# EAGLE design AutoDriver Shield (EAGLE 7.1.0)
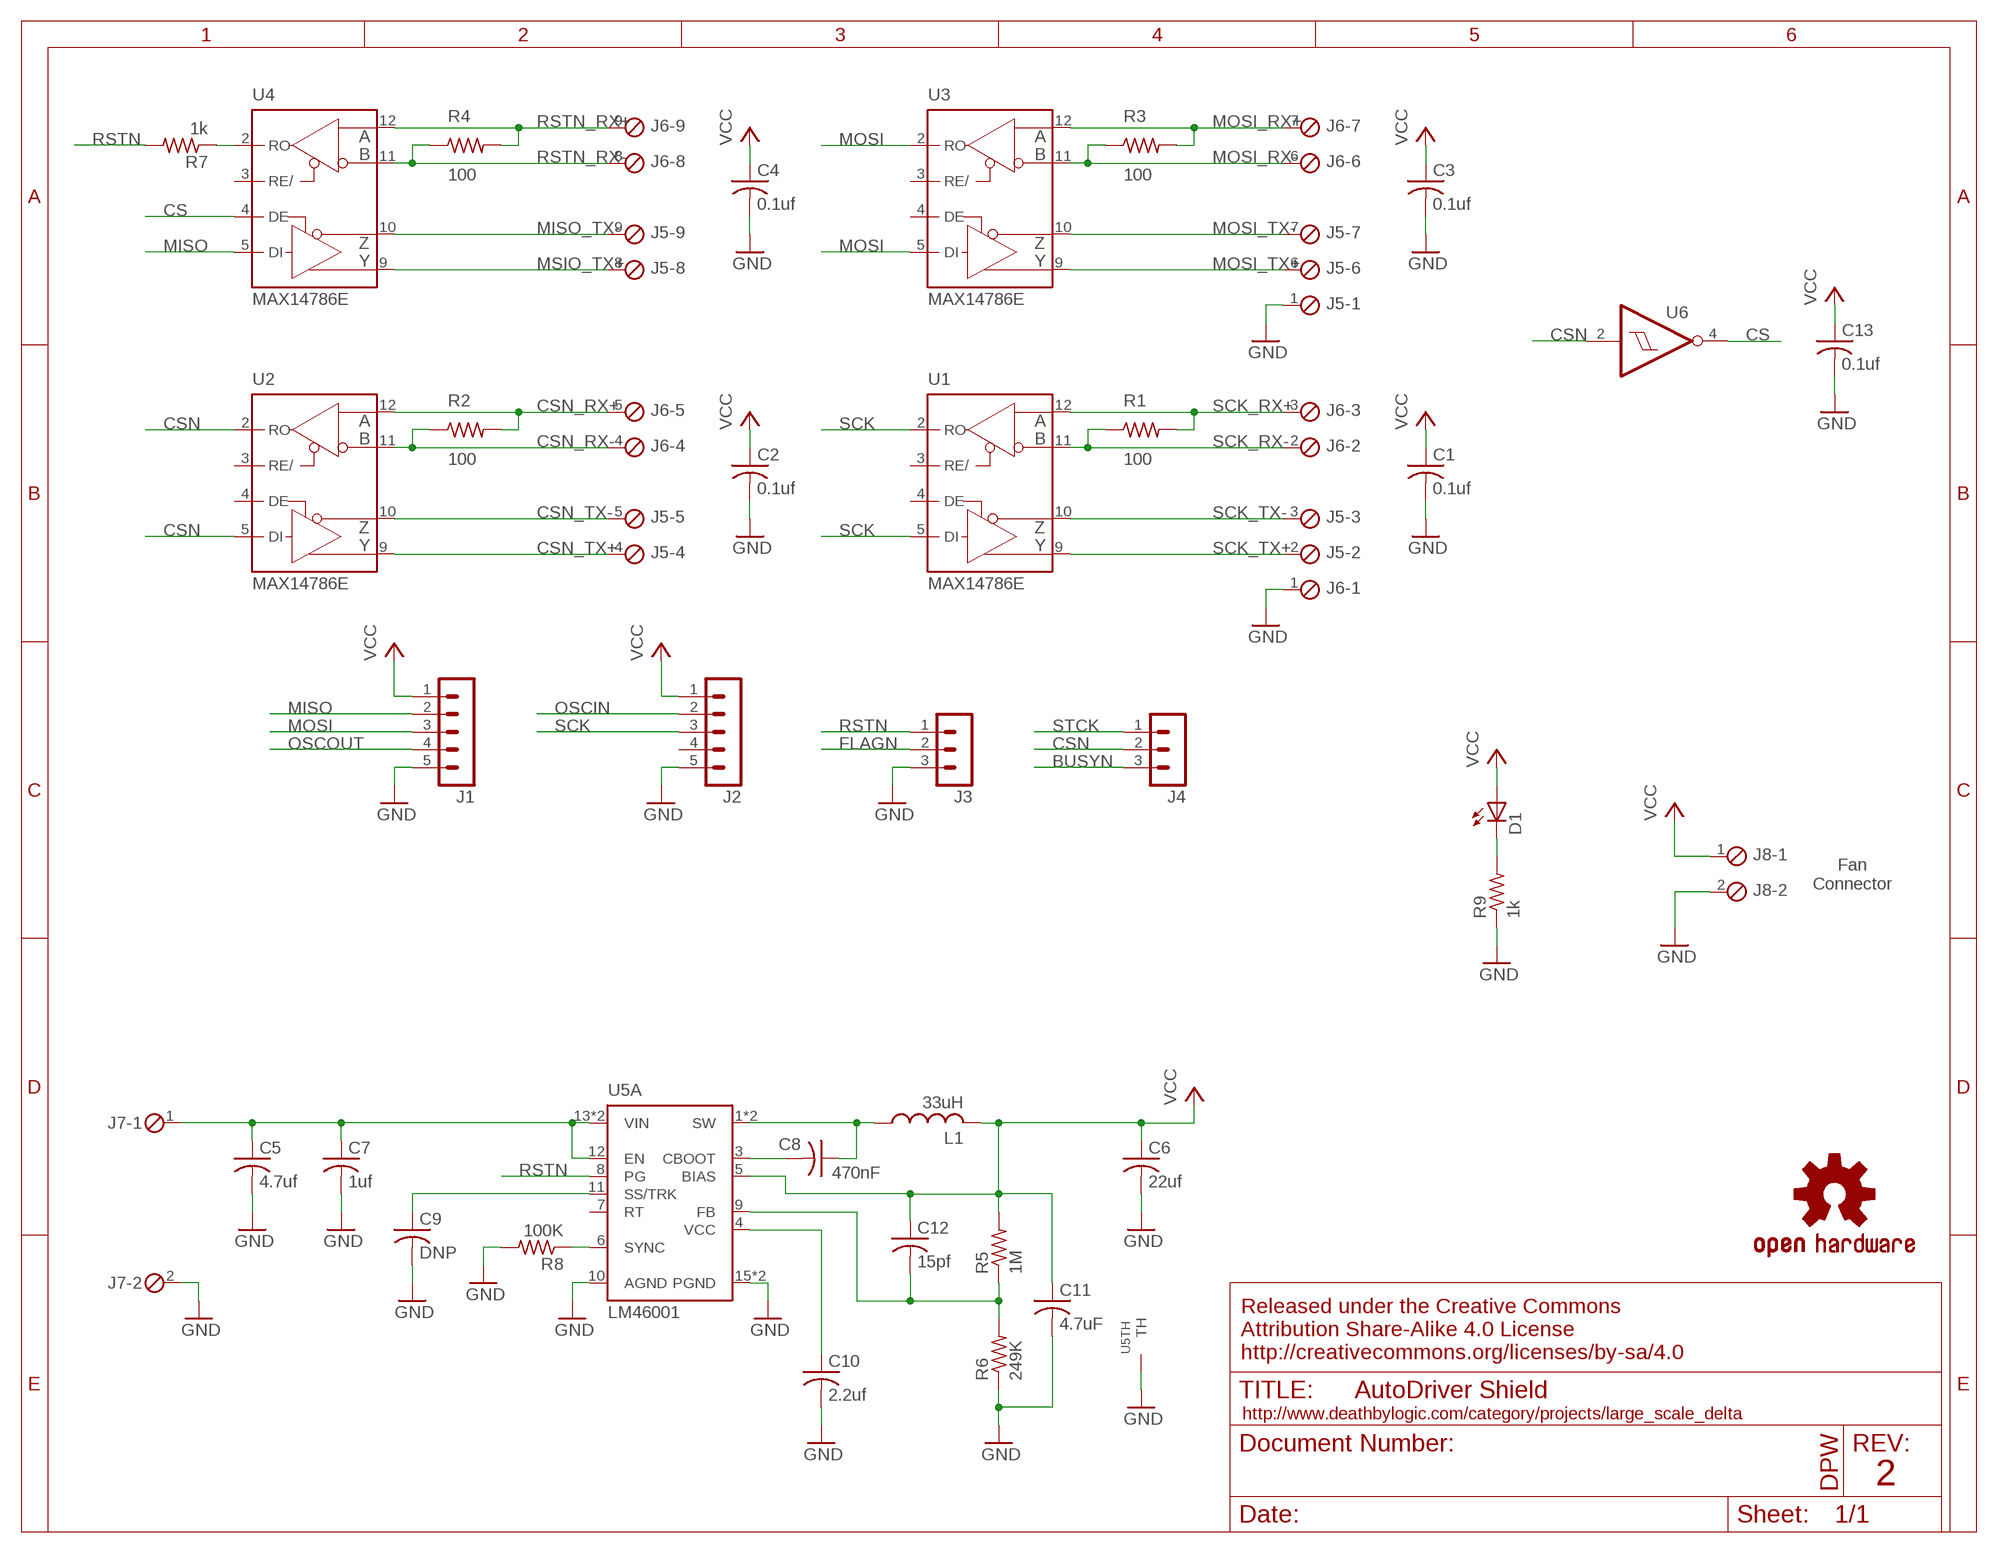
[diagram p0: schematic, sheet 1]

## Parts
C1  0.1uf  C-USC0805K  [C0805K]
C2  0.1uf  C-USC0805K  [C0805K]
C3  0.1uf  C-USC0805K  [C0805K]
C4  0.1uf  C-USC0805K  [C0805K]
C5  4.7uf  C-USC1210K  [C1210K]
C6  22uf  C-USC1210K  [C1210K]
C7  1uf  C-USC1206K  [C1206K]
C8  470nF  C-USC0805K  [C0805K]
C9  DNP  C-USC0603K  [C0603K]
C10  2.2uf  C-USC0603K  [C0603K]
C11  4.7uF  C-USC0805K  [C0805K]
C12  15pf  C-USC0805K  [C0805K]
C13  0.1uf  C-USC0805K  [C0805K]
D1  LEDCHIPLED_0805  [CHIPLED_0805]
J1  MA05-1  [MA05-1]
J2  MA05-1  [MA05-1]
J3  MA03-1  [MA03-1]
J4  MA03-1  [MA03-1]
J5  MPT9  [9POL254]
J6  MPT9  [9POL254]
J7  MPT2  [2POL254]
J8  MPT2  [2POL254]
L1  33uH  SRN6045  [L6045]
LOGO1  OSHW-LOGOM  [OSHW-LOGO-M]
R1  100  R-US_R1206  [R1206]
R2  100  R-US_R1206  [R1206]
R3  100  R-US_R1206  [R1206]
R4  100  R-US_R1206  [R1206]
R5  1M  R-US_R0402  [R0402]
R6  249K  R-US_R0402  [R0402]
R7  1k  R-US_R0805  [R0805]
R8  100K  R-US_R0402  [R0402]
R9  1k  R-US_R0805  [R0805]
U1  MAX14786E  MAX489CSD  [SO14]
U2  MAX14786E  MAX489CSD  [SO14]
U3  MAX14786E  MAX489CSD  [SO14]
U4  MAX14786E  MAX489CSD  [SO14]
U5  LM46001  [HTSSOP16PWP]
U6  74AHC1G14  74AHC1G14DBV  [SOT23-5]
U$2  PENGUIN_LOGOSILKSCREEN  [PENGUIN_SILKSCREEN]

## Nets
BUSYN: J4.3
CS: U4.4(DE) U6.4(O)
CSN: J4.2 U2.2(RO) U2.5(DI) U6.2(I)
CSN_RX+: J6.5 R2.2 U2.12(A)
CSN_RX-: J6.4 R2.1 U2.11(B)
CSN_TX+: J5.4 U2.9(Y)
CSN_TX-: J5.5 U2.10(Z)
FLAGN: J3.2
GND: C1.2 C2.2 C3.2 C4.2 C5.2 C6.2 C7.2 C9.2 C10.2 C11.2 C13.2 J1.5 J2.5 J3.3 J5.1 J6.1 J7.2 J8.2 R6.1 R8.2 R9.1 U5.10(A:AGND) U5.15(A:PGND) U5.16(A:PGND) U5.TH1(TH:TH) U5.TH2(TH:TH) U5.TH3(TH:TH) U5.TH4(TH:TH) U5.TH5(TH:TH) U5.TH6(TH:TH) U5.TH7(TH:TH) U5.TH8(TH:TH) U5.TH9(TH:TH) U5.TH10(TH:TH) U5.TH11(TH:TH) U5.TH12(TH:TH) U5.THA(TH:TH) U5.THB(TH:TH)
MISO: J1.2 U4.5(DI)
MISO_TX-: J5.9 U4.10(Z)
MOSI: J1.3 U3.2(RO) U3.5(DI)
MOSI_RX+: J6.7 R3.2 U3.12(A)
MOSI_RX-: J6.6 R3.1 U3.11(B)
MOSI_TX+: J5.6 U3.9(Y)
MOSI_TX-: J5.7 U3.10(Z)
MSIO_TX+: J5.8 U4.9(Y)
N$1: D1.C R9.2
N$3: C5.1 C7.1 J7.1 U5.12(A:EN) U5.13(A:VIN) U5.14(A:VIN)
N$6: C9.1 U5.11(A:SS/TRK)
N$8: R8.1 U5.6(A:SYNC)
N$9: C8.1 L1.P$1 U5.1(A:SW) U5.2(A:SW)
N$10: C8.2 U5.3(A:CBOOT)
N$11: R7.1 U4.2(RO)
N$12: C10.1 U5.4(A:VCC)
N$15: C12.2 R5.1 R6.2 U5.9(A:FB)
OSCIN: J2.2
OSCOUT: J1.4
RSTN: J3.1 R7.2 U5.8(A:PG)
RSTN_RX+: J6.9 R4.2 U4.12(A)
RSTN_RX-: J6.8 R4.1 U4.11(B)
SCK: J2.3 U1.2(RO) U1.5(DI)
SCK_RX+: J6.3 R1.2 U1.12(A)
SCK_RX-: J6.2 R1.1 U1.11(B)
SCK_TX+: J5.2 U1.9(Y)
SCK_TX-: J5.3 U1.10(Z)
STCK: J4.1
VCC: C1.1 C2.1 C3.1 C4.1 C6.1 C11.1 C12.1 C13.1 D1.A J1.1 J2.1 J8.1 L1.P$2 R5.2 U5.5(A:BIAS)
Unconnected: J2.4 U1.1(NC) U1.3(RE/) U1.4(DE) U1.8(NC) U1.13(NC) U2.1(NC) U2.3(RE/) U2.4(DE) U2.8(NC) U2.13(NC) U3.1(NC) U3.3(RE/) U3.4(DE) U3.8(NC) U3.13(NC) U4.1(NC) U4.3(RE/) U4.8(NC) U4.13(NC) U5.7(A:RT)

## Notes on the sheet
- Fan
  Connector
- Released under the Creative Commons
  Attribution Share-Alike 4.0 License
  http://creativecommons.org/licenses/by-sa/4.0
- http://www.deathbylogic.com/category/projects/large_scale_delta
- 2

## Power pins joined to a net without a drawn wire
GND: U1.6(GND) U1.7(GND) U2.6(GND) U2.7(GND) U3.6(GND) U3.7(GND) U4.6(GND) U4.7(GND) U6.3(GND)
VCC: U1.14(VCC) U2.14(VCC) U3.14(VCC) U4.14(VCC) U6.5(VCC)

## Library data of the parts
C1-C13 = resistor:C-US: CAPACITOR, American symbol
D1 = led:LED: LED OSRAM: - CHIPLED LG R971, LG N971, LY N971, LG Q971, LY Q971, LO R971, LY R971 LH N974, LH R974 LS Q976, LO Q976, LY Q976 LO Q996 - Hyper CHIPLED LW Q18S LB Q993, LB Q99A, LB R99A - SideLED LS A670, LO A670, LY A670, LG A670, LP A670 LB A673, LV A673, LT A673, LW A673 LH A674 LY A675 LS A676, LA A676, LO A676, LY A676, LW A676 LS A679, LY A679, LG A679 - Hyper Micro SIDELED® LS Y876, LA Y876, LO Y876, LY Y876 LT Y87S - SmartLED LW L88C, LW L88S LB L89C, LB L89S, LG L890 LS L89K, LO L89K, LY L89K LS L896, LA L896, LO L896, LY L896 - TOPLED LS T670, LO T670, LY T670, LG T670, LP T670 LSG T670, LSP T670, LSY T670, LOP T670, LYG T670 LG T671, LOG T671, LSG T671 LB T673, LV T673, LT T673, LW T673 LH T674 LS T676, LA T676, LO T676, LY T676, LB T676, LH T676, LSB T676, LW T676 LB T67C, LV T67C, LT T67C, LS T67K, LO T67K, LY T67K, LW E67C LS E67B, LA E67B, LO E67B, LY E67B, LB E67C, LV E67C, LT E67C LW T67C LS T679, LY T679, LG T679 LS T770, LO T770, LY T770, LG T770, LP T770 LB T773, LV T773, LT T773, LW T773 LH T774 LS E675, LA E675, LY E675, LS T675 LS T776, LA T776, LO T776, LY T776, LB T776 LHGB T686 LT T68C, LB T68C - Hyper Mini TOPLED® LB M676 - Mini TOPLED Santana® LG M470 LS M47K, LO M47K, LY M47K Source: http://www.osram.convergy.de LUXEON: - LUMILED® LXK2-PW12-R00, LXK2-PW12-S00, LXK2-PW14-U00, LXK2-PW14-V00 LXK2-PM12-R00, LXK2-PM12-S00, LXK2-PM14-U00 LXK2-PE12-Q00, LXK2-PE12-R00, LXK2-PE12-S00, LXK2-PE14-T00, LXK2-PE14-U00 LXK2-PB12-K00, LXK2-PB12-L00, LXK2-PB12-M00, LXK2-PB14-N00, LXK2-PB14-P00, LXK2-PB14-Q00 LXK2-PR12-L00, LXK2-PR12-M00, LXK2-PR14-Q00, LXK2-PR14-R00 LXK2-PD12-Q00, LXK2-PD12-R00, LXK2-PD12-S00 LXK2-PH12-R00, LXK2-PH12-S00 LXK2-PL12-P00, LXK2-PL12-Q00, LXK2-PL12-R00 Source: www.luxeon.com KINGBRIGHT: KA-3528ASYC Source: www.kingbright.com
J1 J2 = con-lstb:MA05-1: PIN HEADER; OC_FARNELL: unknown; OC_NEWARK: unknown
J3 J4 = con-lstb:MA03-1: PIN HEADER; OC_FARNELL: unknown; OC_NEWARK: unknown
J5 J6 = con-phoenix-254:MPT9: PHOENIX CONNECTOR; OC_FARNELL: unknown; OC_NEWARK: unknown
J7 J8 = con-phoenix-254:MPT2: PHOENIX CONNECTOR; OC_FARNELL: unknown; OC_NEWARK: unknown
L1 = Auto Driver Shield:SRN6045
LOGO1 = SparkFun-Aesthetics:OSHW-LOGO: Open Source Hardware Logo This logo indicates the piece of hardware it is found on incorporates a OSHW license and/or adheres to the definition of open source hardware found here: http://freedomdefined.org/OSHW
R1-R4 R7 R9 = rcl:R-US_: RESISTOR, American symbol
R5 R6 R8 = resistor:R-US_: RESISTOR, American symbol
U1-U4 = maxim:MAX489CSD: RS485 TRANSEIVER; MF: MAXIM; MPN: MAX489CSD; OC_FARNELL: 9724559; OC_NEWARK: 34C3923
U5 = Auto Driver Shield:LM46001
U6 = 74xx-little-us:74*1G14: Single Schmitt-Trigger Inverter Gate
U$2 = custom:PENGUIN_LOGO

## Board
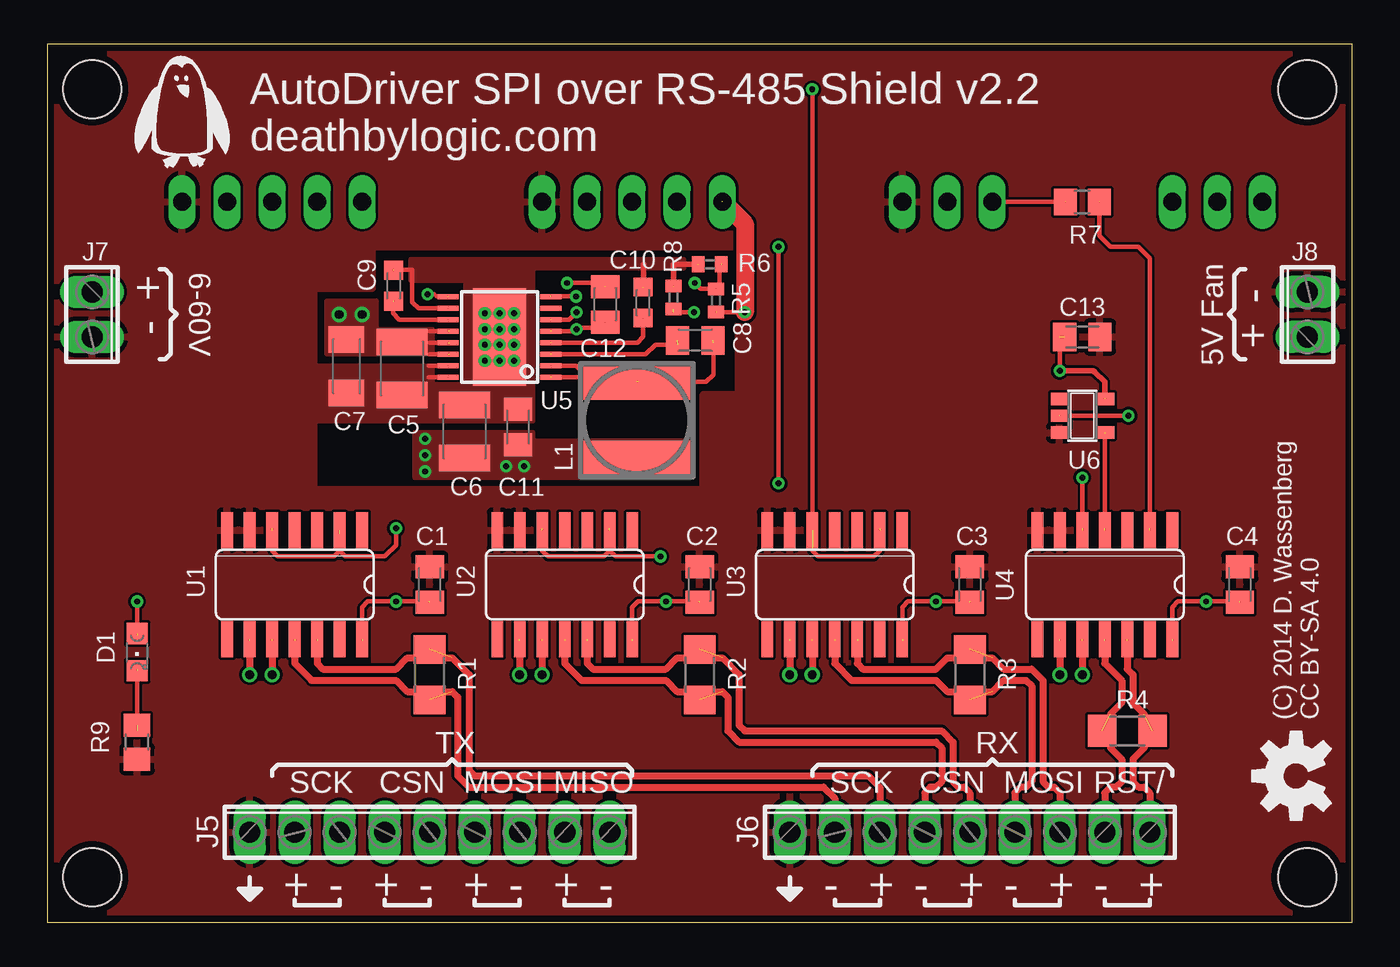
[diagram p1: board, top side]
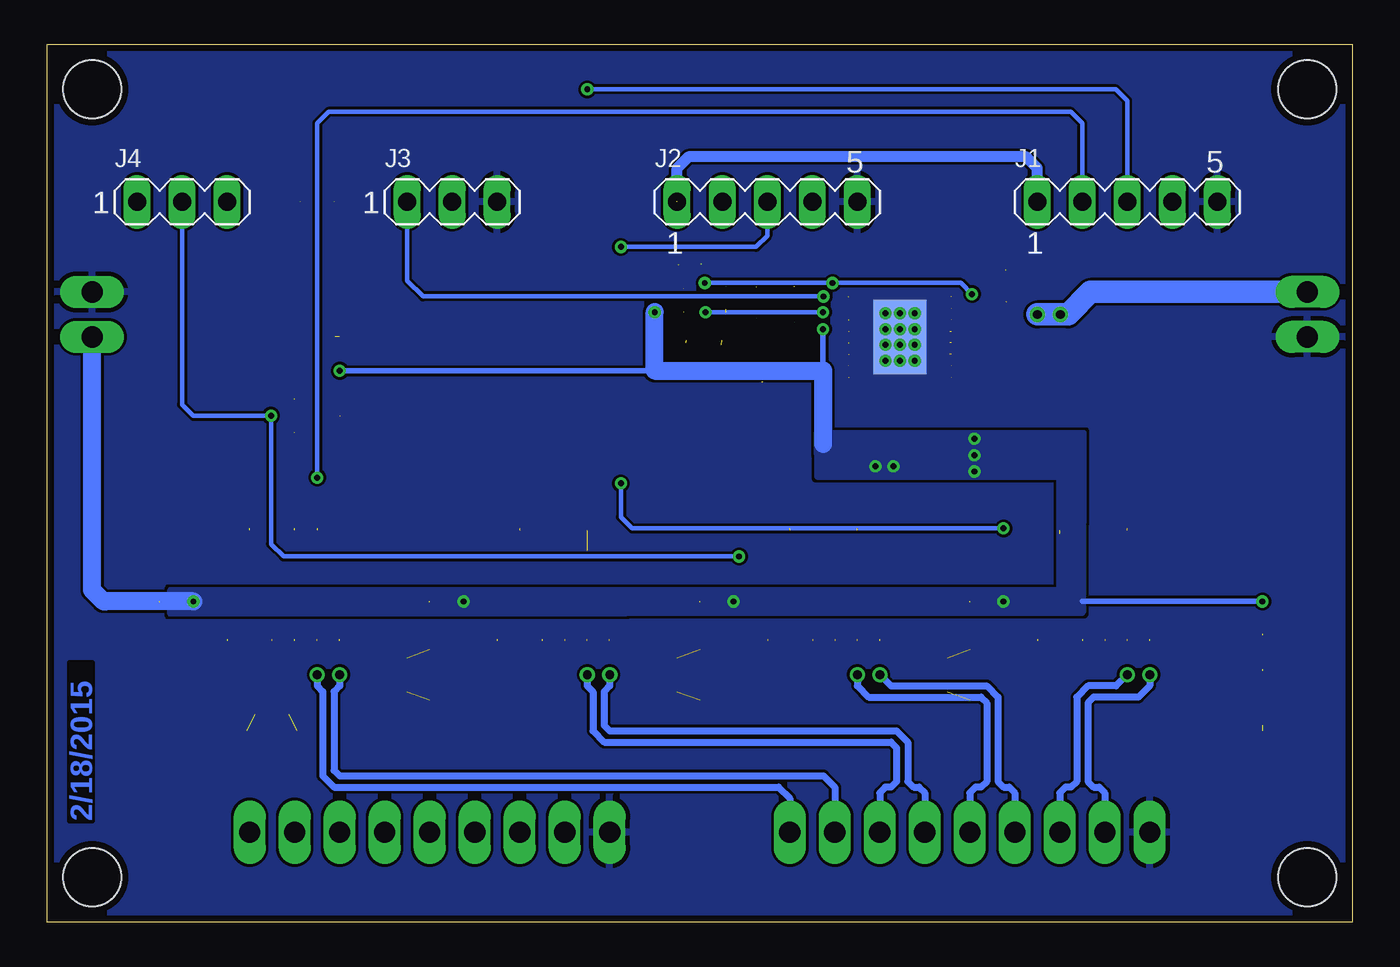
[diagram p2: board, bottom side, seen from below]

Size 73.66 x 49.53 mm. Coordinates in mm from the lower left corner, seen from the top.
Outline: 0,0 73.66,0 73.66,49.53 0,49.53 0,0
Copper layers (1*16): Top 0.0356mm / dielectric 1.5011mm / Bottom 0.0356mm
Design rules "LaenPCBOrder *": minimum track width 6mil, minimum drill 13mil, track to track 6mil, track to pad 6mil, pad to pad 6mil, via to via 6mil, smd to smd 6mil, copper to edge 15mil, drill to drill 6mil, minimum pad ring 7mil, minimum via ring 7mil, stop-mask expansion 4mil, vias tented up to drill 25mil, thermal gap 10mil

### Footprints (pad centres in the part's own frame; a part is rotated, then mirrored left to right if it is on the bottom)
C0805K = smd 1.3 x 1.6: 1 -1,0; 2 1,0
C1210K = smd 1.5 x 2.9: 1 -1.5,0; 2 1.5,0
C1206K = smd 1.5 x 2: 1 -1.5,0; 2 1.5,0
C0603K = smd 1.05 x 1.08: 1 -0.875,0; 2 0.875,0
CHIPLED_0805 = smd 1.2 x 1.2: A 0,-1.05; C 0,1.05
MA05-1 = drill 1.016 long: 1 -5.08,0; 2 -2.54,0; 3 0,0; 4 2.54,0; 5 5.08,0
MA03-1 = drill 1.016 long: 1 -2.54,0; 2 0,0; 3 2.54,0
9POL254 = drill 1.2 long: 1 -10.16,0; 2 -7.62,0; 3 -5.08,0; 4 -2.54,0; 5 0,0; 6 2.54,0; 7 5.08,0; 8 7.62,0; 9 10.16,0
2POL254 = drill 1.2 long: 1 -1.27,0; 2 1.27,0
L6045 = smd 2.007 x 5.994: P$1 -2.159,0; P$2 2.159,0
R1206 = smd 1.6 x 1.803: 1 -1.422,0; 2 1.422,0
R0402 = smd 0.7 x 0.9: 1 -0.65,0; 2 0.65,0
R0805 = smd 1.3 x 1.5: 1 -0.95,0; 2 0.95,0
STAND-OFF = hole 3.302: 0,0
SO14 = smd 0.66 x 2.032: 1 -3.81,-3.073; 2 -2.54,-3.073; 3 -1.27,-3.073; 4 0,-3.073; 5 1.27,-3.073; 6 2.54,-3.073; 7 3.81,-3.073; 8 3.81,3.073; 9 2.54,3.073; 10 1.27,3.073; 11 0,3.073; 12 -1.27,3.073; 13 -2.54,3.073; 14 -3.81,3.073
HTSSOP16PWP = smd 0.27 x 1.2: 1 -2.275,-2.9; 2 -1.625,-2.9; 3 -0.975,-2.9; 4 -0.325,-2.9; 5 0.325,-2.9; 6 0.975,-2.9; 7 1.625,-2.9; 8 2.275,-2.9; 9 2.275,2.9; 10 1.625,2.9; 11 0.975,2.9; 12 0.325,2.9; 13 -0.325,2.9; 14 -0.975,2.9; 15 -1.625,2.9; 16 -2.275,2.9 | drill 0.33 pad 0.61: TH1 -1.333,0.826; TH2 -1.333,0; TH3 -1.333,-0.826; TH4 -0.445,0.826; TH5 -0.445,0; TH6 -0.445,-0.826; TH7 0.445,0.826; TH8 0.445,0; TH9 0.445,-0.826; TH10 1.333,0.826; TH11 1.333,0; TH12 1.333,-0.826 | smd 5.5 x 3: THA 0,0 | smd 4.18 x 3 bottom: THB 0,0
SOT23-5 = smd 0.69 x 0.99: 1 -0.95,-1.29; 2 0,-1.29; 3 0.95,-1.29; 4 0.95,1.3; 5 -0.95,1.3

### Placement (x,y rotation side)
C1  21.59,19.05 90 top
C2  36.83,19.05 90 top
C3  52.07,19.05 90 top
C4  67.31,19.05 90 top
C5  20.03,31.24 270 top
C6  23.56,27.69 90 top
C7  16.89,31.37 270 top
C8  36.58,32.83 180 top
C9  19.56,35.91 90 top
C10  33.62,34.96 90 top
C11  26.57,27.94 90 top
C12  31.5,34.86 90 top
C13  58.42,33.02 0 top
D1  5.08,15.24 180 top
J1  12.7,40.64 0 bottom
J2  33.02,40.64 0 bottom
J3  50.8,40.64 0 bottom
J4  66.04,40.64 0 bottom
J5  21.59,5.08 0 top
J6  52.07,5.08 0 top
J7  2.54,34.29 270 top
J8  71.12,34.29 90 top
L1  33.27,28.32 270 top
LOGO1  70.48,8.26 90 top
R1  21.59,13.97 90 top
R2  36.83,13.97 90 top
R3  52.07,13.97 90 top
R4  60.96,10.79 0 top
R5  37.75,35.08 270 top
R6  37.4,37.12 0 top
R7  58.42,40.64 180 top
R8  35.34,35.24 90 top
R9  5.08,10.16 90 top
STANDOFF1  STAND-OFF  [STAND-OFF]  71.12,46.99 90 top
STANDOFF2  STAND-OFF  [STAND-OFF]  71.12,2.54 90 top
STANDOFF3  STAND-OFF  [STAND-OFF]  2.54,2.54 90 top
STANDOFF4  STAND-OFF  [STAND-OFF]  2.54,46.99 90 top
U1  13.97,19.05 180 top
U2  29.21,19.05 180 top
U3  44.45,19.05 180 top
U4  59.69,19.05 180 top
U5  25.53,33.02 90 top
U6  58.42,28.57 270 top
U$2  7.62,45.72 0 top

### Tracks (layer width: path | path; a pad name or v marks a point on that pad's centre or on a via)
CS  (2 unrouted)
  Top 0.254: 59.69,22.23 59.69,27.62 60.01,27.62
CSN  (via drill 0.33)  (3 unrouted)
  Top 0.254: 27.94,22.23 27.94,20.95 28.26,20.64 31.43,20.64 31.75,20.95 | 31.75,20.95 31.75,22.23 | 31.75,20.95 32.07,20.64 v34.61,20.64 | v61.02,28.57 57.15,28.57
  Bottom 0.254: J4.2 66.04,29.21 65.41,28.57 v61.02,28.57 61.02,21.34 60.33,20.64 v34.61,20.64
CSN_RX+  (2 unrouted)
  Top 0.406: 30.48,15.88 30.48,14.61 30.8,14.29 34.92,14.29 35.56,14.92 38.1,14.92 39.05,13.97 39.05,11.11 39.37,10.79 50.48,10.79 51.12,10.16 51.12,7.94 51.44,7.62 51.75,7.62 52.07,7.3 J6.5
CSN_RX-  (2 unrouted)
  Top 0.406: 29.21,15.88 29.21,14.61 30.16,13.65 34.92,13.65 35.56,13.02 38.1,13.02 38.42,12.7 38.42,10.79 39.05,10.16 50.16,10.16 50.48,9.84 50.48,7.94 50.16,7.62 49.85,7.62 49.53,7.3 J6.4
CSN_TX+  (via drill 0.5)  (1 unrouted)
  Top 0.406: 26.67,15.88 v26.67,13.97
  Bottom 0.406: v26.67,13.97 26.04,13.34 20.64,13.34 20,12.7 20,7.94 19.68,7.62 19.37,7.62 19.05,7.3 J5.4
CSN_TX-  (via drill 0.5)  (1 unrouted)
  Top 0.406: 27.94,15.88 v27.94,13.97
  Bottom 0.406: v27.94,13.97 27.94,13.34 27.3,12.7 20.95,12.7 20.64,12.38 20.64,7.94 20.95,7.62 21.27,7.62 21.59,7.3 J5.5
GND  (7 unrouted)
  Top 0.254: U5.10 20.95,34.64 20.61,34.99 20.61,36.8 19.56,36.8 | U5.15 21.53,31.4 | 22.64,30.73 21.53,30.73
  Top 0.305: 33.66,35.81 33.66,37.12 | 35.34,35.88 35.34,37.12 36.73,37.12
  pour Top (rank 6): 0,0 0,35.75 15.05,35.75 15.05,24.42 37.02,24.42 37.02,29.78 39.02,29.78 38.99,38.07 18.35,38.07 18.35,35.75 -0.06,35.75 0,49.53 73.66,49.53 73.66,0
  pour Top (isolate 0.254, no thermals): 27.43,36.89 27.43,28.26 13.97,28.26 13.97,31.4 21.75,31.4 21.75,30.35 23.62,30.35 23.62,36.2 20.51,36.2 20.51,37.4 35.94,37.4 35.94,36.89
  pour Bottom: 22.54,35.56 22.54,30.48 28.57,30.48 28.57,35.56
  pour Bottom (rank 6): 0,49.53 73.66,49.53 73.66,0 0,0
MISO  (via drill 0.33)  (1 unrouted)
  Top 0.254: v58.42,25.08 58.42,22.23
  Bottom 0.254: v58.42,25.08 58.42,45.09 57.78,45.72 15.88,45.72 15.24,45.09 J1.2
MISO_TX-  (via drill 0.5)  (1 unrouted)
  Top 0.406: 58.42,15.88 v58.42,13.97
  Bottom 0.406: v58.42,13.97 58.42,13.34 58.1,13.02 58.1,8.26 57.47,7.62 32.38,7.62 31.75,6.99 J5.9
MOSI  (via drill 0.33)  (2 unrouted)
  Top 0.254: v43.18,46.99 43.18,20.95 43.5,20.64 46.67,20.64 46.99,20.95 46.99,22.23
  Bottom 0.254: J1.3 12.7,46.35 13.34,46.99 v43.18,46.99
MOSI_RX+  (2 unrouted)
  Top 0.406: 45.72,15.88 45.72,14.61 46.04,14.29 50.16,14.29 50.8,14.92 53.34,14.92 53.98,14.29 55.56,14.29 56.2,13.65 56.2,7.94 56.52,7.62 56.83,7.62 57.15,7.3 J6.7
MOSI_RX-  (2 unrouted)
  Top 0.406: 44.45,15.88 44.45,14.61 45.4,13.65 50.16,13.65 50.8,13.02 53.34,13.02 53.98,13.65 55.24,13.65 55.56,13.34 55.56,7.94 55.24,7.62 54.93,7.62 54.61,7.3 J6.6
MOSI_TX+  (via drill 0.5)  (1 unrouted)
  Top 0.406: 41.91,15.88 v41.91,13.97
  Bottom 0.406: v41.91,13.97 41.91,13.34 42.23,13.02 42.23,11.11 41.91,10.79 25.72,10.79 25.08,10.16 25.08,7.94 24.77,7.62 24.45,7.62 24.13,7.3 J5.6
MOSI_TX-  (via drill 0.5)  (1 unrouted)
  Top 0.406: 43.18,15.88 v43.18,13.97
  Bottom 0.406: v43.18,13.97 43.18,13.34 42.86,13.02 42.86,10.79 42.23,10.16 26.04,10.16 25.72,9.84 25.72,7.94 26.04,7.62 26.35,7.62 26.67,7.3 J5.7
MSIO_TX+  (via drill 0.5)  (1 unrouted)
  Top 0.406: 57.15,15.88 v57.15,13.97
  Bottom 0.406: v57.15,13.97 57.15,13.34 57.47,13.02 57.47,8.57 57.15,8.26 29.84,8.26 29.21,7.62 J5.8
N$1  (2 unrouted)
  Top 0.254: 5.08,14.29 5.08,10.79
N$3  (via drill 0.5)  (3 unrouted)
  Top 0.254: 22.7,33.34 21.59,33.34 | 22.7,32.7 21.59,32.7 | 22.7,32.04 21.59,32.04
  Bottom 1.27: J7.1 14.8,35.56 16.03,34.29 v17.78,34.29
  other vias: 16.48,34.29
  pour Top (isolate 0.254, no thermals): 21.75,32.04 15.78,32.04 15.78,35.05 18.61,35.05 18.61,33.46 21.75,33.46
N$6  (2 unrouted)
  Top 0.254: U5.11 19.88,34 19.53,34.35 19.53,35.02
N$8  (via drill 0.33)  (2 unrouted)
  Top 0.254: 28.42,34 29.46,34 v29.88,34.42 | v36.51,34.42 35.34,34.42
  Bottom 0.254: v29.88,34.42 v36.51,34.42
N$9  (4 unrouted)
  Top 0.254: 28.45,31.4 29.84,31.4 30.48,30.73 28.42,30.73 | L1.P$1 37.18,30.48 37.59,30.89 37.59,32.7
  Top 0.305: 30.48,30.73 33.08,30.73 33.34,30.48
N$10  (2 unrouted)
  Top 0.254: 28.42,32.04 33.78,32.04 34.32,32.58 35.59,32.58
N$11  (2 unrouted)
  Top 0.254: R7.1 59.37,38.73 60.01,38.1 61.59,38.1 62.23,37.47 62.23,22.23
N$12  (2 unrouted)
  Top 0.254: 28.42,32.7 33.31,32.7 33.62,33.02 33.62,34.07
N$15  (via drill 0.33)  (4 unrouted)
  Top 0.254: U5.9 21.97,35.31 21.84,35.43 v21.46,35.43 | v29.34,36.07 31.5,36.07 31.5,35.88 | v36.54,36.07 36.86,35.75 37.75,35.75 37.94,35.94 37.94,36.99 38.04,37.08
  Bottom 0.254: v21.46,35.43 22.1,36.07 v29.34,36.07 v36.54,36.07
RSTN  (via drill 0.33)  (2 unrouted)
  Top 0.254: 28.42,35.31 v29.84,35.31 | J3.1 R7.2
  Bottom 0.254: v29.84,35.31 52.45,35.31 53.34,36.2 J3.1
RSTN_RX+  (2 unrouted)
  Top 0.406: 60.96,15.88 60.96,14.29 61.28,13.97 61.28,12.38 61.91,11.75 61.91,9.84 61.28,9.21 61.28,7.94 61.59,7.62 61.91,7.62 62.23,7.3 J6.9
RSTN_RX-  (2 unrouted)
  Top 0.406: 59.69,15.88 59.69,14.61 60.64,13.65 60.64,12.38 60.01,11.75 60.01,9.84 60.64,9.21 60.64,7.94 60.33,7.62 60.01,7.62 59.69,7.3 J6.8
SCK  (via drill 0.33)  (2 unrouted)
  Top 0.254: 12.7,22.23 12.7,20.95 13.02,20.64 16.19,20.64 16.51,20.95 | v41.27,38.1 v41.27,24.77 | v19.68,22.23 19.68,21.27 19.05,20.64 16.83,20.64 16.51,20.95 | 16.51,20.95 16.51,21.91
  Bottom 0.254: J2.3 33.02,38.73 33.66,38.1 v41.27,38.1 | v41.27,24.77 41.27,22.86 40.64,22.23 v19.68,22.23
SCK_RX+  (2 unrouted)
  Top 0.406: 15.24,15.88 15.24,14.61 15.56,14.29 19.68,14.29 20.32,14.92 22.86,14.92 23.81,13.97 23.81,8.57 24.13,8.26 46.35,8.26 46.99,7.62 J6.3
SCK_RX-  (2 unrouted)
  Top 0.406: 13.97,15.88 13.97,14.61 14.92,13.65 19.68,13.65 20.32,13.02 22.86,13.02 23.18,12.7 23.18,8.26 23.81,7.62 43.81,7.62 44.45,6.99 J6.2
SCK_TX+  (via drill 0.5)  (1 unrouted)
  Top 0.406: 11.43,15.88 v11.43,13.97
  Bottom 0.406: v11.43,13.97 11.43,13.34 12.06,12.7 14.61,12.7 14.92,12.38 14.92,7.94 14.61,7.62 14.29,7.62 13.97,7.3 J5.2
SCK_TX-  (via drill 0.5)  (1 unrouted)
  Top 0.406: 12.7,15.88 v12.7,13.97
  Bottom 0.406: v12.7,13.97 13.34,13.34 14.92,13.34 15.56,12.7 15.56,7.94 15.88,7.62 16.19,7.62 16.51,7.3 J5.3
VCC  (via drill 0.33)  (15 unrouted)
  Top 0.254: 48.26,15.88 48.26,17.78 48.58,18.1 v50.16,18.1 52.07,18.1 | 63.5,15.88 63.5,17.78 63.82,18.1 v65.41,18.1 67.31,18.1 | 33.02,15.88 33.02,17.78 33.34,18.1 v34.92,18.1 36.83,18.1 | 17.78,15.88 17.78,17.78 18.1,18.1 v19.68,18.1 21.59,18.1 | 5.08,16.19 v5.08,18.1 | 57.15,33.02 v57.15,31.11 | 28.42,33.34 29.75,33.34 v29.88,33.47 29.94,33.53 31.5,33.53 31.5,33.85 | v39.37,34.42 37.75,34.42
  Top 0.305: 59.69,29.53 59.69,30.48 59.13,31.04 arc45 58.95,31.11 v57.15,31.11
  Top 1.016: 38.1,40.67 39.37,39.4 v39.37,34.42
  Bottom 0.305: v29.88,33.47 29.88,31.11 | v5.08,18.1 15.24,18.1 | v57.15,31.11 39.37,31.11
  Bottom 0.61: J1.1 17.78,42.55 18.34,43.11 arc-45 18.41,43.18 37.47,43.18 38.1,42.55 J2.1
  Bottom 1.016: 29.88,26.99 29.88,31.11 39.37,31.11 v39.37,34.42 | v65.41,18.1 70.38,18.1 arc45 70.56,18.17 71.12,18.73 J8.1
  other vias: 21.34,25.43 21.34,26.35 26.92,25.72 21.34,27.27 25.91,25.72
  pour Top (isolate 0.254, no thermals): 20.73,27.65 27.43,27.65 27.43,27.18 36.32,27.18 36.32,25.08 20.73,25.08
  pour Bottom: 15.21,27.59 15.24,17.46 66.67,17.4 66.67,18.73 16.51,18.73 16.51,25.15 30.16,25.15 30.19,27.59

### Text on the board
Bottom: 2/18/2015
tPlace: AutoDriver SPI over RS-485 Shield v2.2 / deathbylogic.com | + | - | - | 6-60V | 5V Fan | + | (C) 2014 D. Wassenberg / CC BY-SA 4.0 | TX | RX | SCK | CSN | MOSI | MISO | SCK | CSN | MOSI | RST/ | + | - | + | - | + | - | + | - | - | + | - | + | - | + | - | +